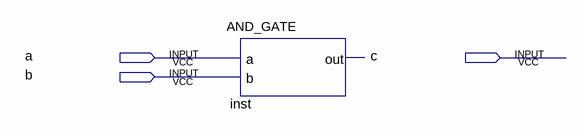
[diagram p0: schematic sheet]
// Quartus schematic AND_GATE_BLOCK.bdf as structural Verilog: 1 symbols, 3 pins
module AND_GATE_BLOCK (
  input  a,
  input  c,
  input  b
);

  AND_GATE inst (.a(a), .b(b));  // open: out
endmodule
